# Altium schematic sheet Main.SchDoc
size A4
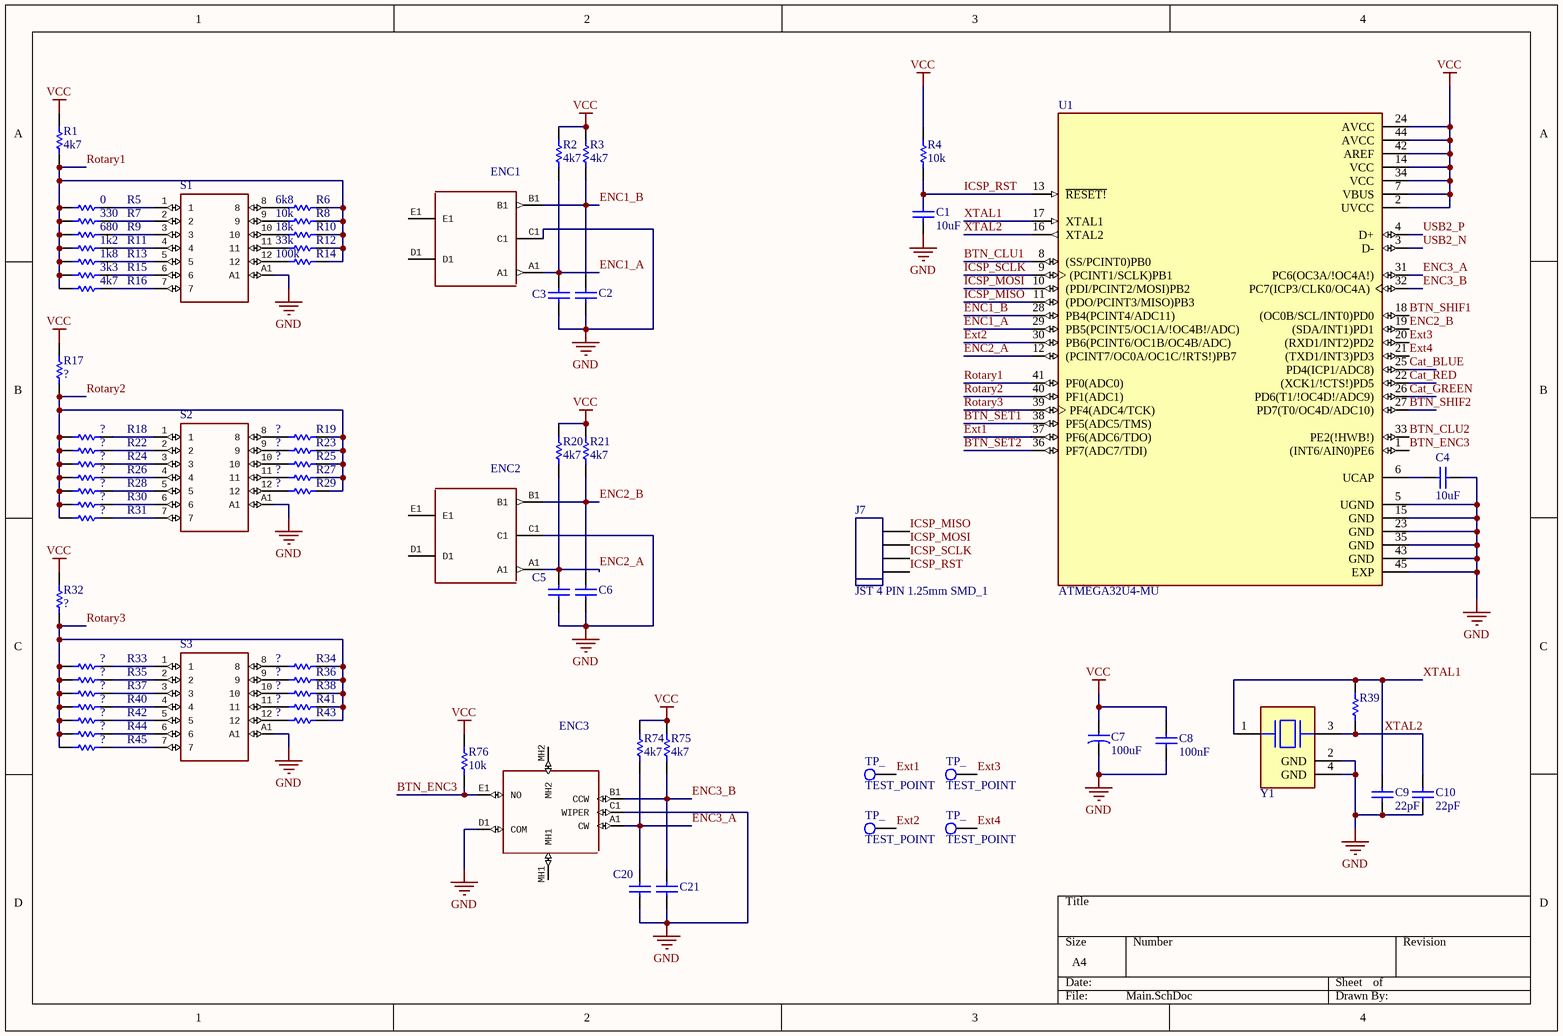
[diagram p0: Main.SchDoc]

## Parts
(Parts that share a designator on the sheet are numbered #1, #2 ... from top to bottom, then left to right.)
C1  10uF  [0603]
C2  100nF  [0603]  (value not drawn)
C3  100nF  [0603]  (value not drawn)
C4  10uF  [0603]
C5  100nF  [0603]  (value not drawn)
C6  100nF  [0603]  (value not drawn)
C7  100uF  [CAPPC3528X210N]
C8  100nF  [0603]
C9  22pF  [0603]
C10  22pF  [0603]
C20  100nF  [0603]  (value not drawn)
C21  100nF  [0603]  (value not drawn)
ENC1  Horz Encoder  [EC11B15242AF]  (value not drawn)
ENC2  Horz Encoder  [EC11B15242AF]  (value not drawn)
ENC3  EC1110120201  [EC1110120201]  (value not drawn)
J7  JST 4 PIN 1.25mm SMD_1  [JST 4 Pin 1.25mm]
R1  value 4k7  [0603]
R2  value 4k7  [0603]  (hidden comment: RESISTOR GENERIC)
R3  value 4k7  [0603]  (hidden comment: RESISTOR GENERIC)
R4  value 10k  [0603]  (hidden comment: RESISTOR GENERIC)
R5  value 0  [0603]  (hidden comment: RESISTOR GENERIC)
R6  value 6k8  [0603]  (hidden comment: RESISTOR GENERIC)
R7  value 330  [0603]  (hidden comment: RESISTOR GENERIC)
R8  value 10k  [0603]  (hidden comment: RESISTOR GENERIC)
R9  value 680  [0603]  (hidden comment: RESISTOR GENERIC)
R10  value 18k  [0603]  (hidden comment: RESISTOR GENERIC)
R11  value 1k2  [0603]  (hidden comment: RESISTOR GENERIC)
R12  value 33k  [0603]  (hidden comment: RESISTOR GENERIC)
R13  value 1k8  [0603]  (hidden comment: RESISTOR GENERIC)
R14  value 100k  [0603]  (hidden comment: RESISTOR GENERIC)
R15  value 3k3  [0603]  (hidden comment: RESISTOR GENERIC)
R16  value 4k7  [0603]  (hidden comment: RESISTOR GENERIC)
R17  RESISTOR GENERIC  [0603]  (value not drawn)
R18  RESISTOR GENERIC  [0603]  (value not drawn)
R19  RESISTOR GENERIC  [0603]  (value not drawn)
R20  value 4k7  [0603]  (hidden comment: RESISTOR GENERIC)
R21  value 4k7  [0603]  (hidden comment: RESISTOR GENERIC)
R22  RESISTOR GENERIC  [0603]  (value not drawn)
R23  RESISTOR GENERIC  [0603]  (value not drawn)
R24  RESISTOR GENERIC  [0603]  (value not drawn)
R25  RESISTOR GENERIC  [0603]  (value not drawn)
R26  RESISTOR GENERIC  [0603]  (value not drawn)
R27  RESISTOR GENERIC  [0603]  (value not drawn)
R28  RESISTOR GENERIC  [0603]  (value not drawn)
R29  RESISTOR GENERIC  [0603]  (value not drawn)
R30  RESISTOR GENERIC  [0603]  (value not drawn)
R31  RESISTOR GENERIC  [0603]  (value not drawn)
R32  RESISTOR GENERIC  [0603]  (value not drawn)
R33  RESISTOR GENERIC  [0603]  (value not drawn)
R34  RESISTOR GENERIC  [0603]  (value not drawn)
R35  RESISTOR GENERIC  [0603]  (value not drawn)
R36  RESISTOR GENERIC  [0603]  (value not drawn)
R37  RESISTOR GENERIC  [0603]  (value not drawn)
R38  RESISTOR GENERIC  [0603]  (value not drawn)
R39  RESISTOR GENERIC  [0603]  (value not drawn)
R40  RESISTOR GENERIC  [0603]  (value not drawn)
R41  RESISTOR GENERIC  [0603]  (value not drawn)
R42  RESISTOR GENERIC  [0603]  (value not drawn)
R43  RESISTOR GENERIC  [0603]  (value not drawn)
R44  RESISTOR GENERIC  [0603]  (value not drawn)
R45  RESISTOR GENERIC  [0603]  (value not drawn)
R74  value 4k7  [0603]  (hidden comment: RESISTOR GENERIC)
R75  value 4k7  [0603]  (hidden comment: RESISTOR GENERIC)
R76  value 10k  [0603]  (hidden comment: RESISTOR GENERIC)
S1  <b>Rotary wafer switch,metric,BBM,1P 12way 150 mA@ 250V, 12 Way Rotary Switch, 250 V ac, 250 V dc</b><p> / Source: <a href="https://www.mouser.co.uk/datasheet/2/242/CK-681.pdf"> Datasheet </a>  [CK1059]  (value not drawn)
S2  <b>Rotary wafer switch,metric,BBM,1P 12way 150 mA@ 250V, 12 Way Rotary Switch, 250 V ac, 250 V dc</b><p> / Source: <a href="https://www.mouser.co.uk/datasheet/2/242/CK-681.pdf"> Datasheet </a>  [CK1059]  (value not drawn)
S3  <b>Rotary wafer switch,metric,BBM,1P 12way 150 mA@ 250V, 12 Way Rotary Switch, 250 V ac, 250 V dc</b><p> / Source: <a href="https://www.mouser.co.uk/datasheet/2/242/CK-681.pdf"> Datasheet </a>  [CK1059]  (value not drawn)
TP_#1  TEST_POINT  [TEST_POINT]  (no BOM)
TP_#2  TEST_POINT  [TEST_POINT]  (no BOM)
TP_#3  TEST_POINT  [TEST_POINT]  (no BOM)
TP_#4  TEST_POINT  [TEST_POINT]  (no BOM)
U1  ATMEGA32U4-MU  [QFN50P700X700X100-45N]
Y1  XTAL 16MHz 30PPM SXC32M4-16.000-F16NLDT  [SMD3225-4P]  (value not drawn)

## Nets
GND: C1.1 C2.1 C3.1 C4.1 C5.1 C6.1 C7.2(-) C8.1 C9.1 C10.1 C20.1 C21.1 ENC1.C1 ENC2.C1 ENC3.C1(WIPER) ENC3.D1(COM) S1.A1 S2.A1 S3.A1 U1.5(UGND) U1.15(GND) U1.23(GND) U1.35(GND) U1.43(GND) U1.45(EXP) Y1.2(GND) Y1.4(GND)
VCC: C7.1(+) C8.2 R1.2 R2.2 R3.2 R4.2 R17.2 R20.2 R21.2 R32.2 R74.2 R75.2 R76.2 U1.2(UVCC) U1.7(VBUS) U1.14(VCC) U1.24(AVCC) U1.34(VCC) U1.42(AREF) U1.44(AVCC)
BTN_CLU1: U1.8((SS/PCINT0)PB0)
BTN_CLU2: U1.33(PE2(!HWB!))
BTN_ENC3: ENC3.E1(NO) R76.1 U1.1((INT6/AIN0)PE6)
BTN_SET1: U1.38(PF5(ADC5/TMS))
BTN_SET2: U1.36(PF7(ADC7/TDI))
BTN_SHIF1: U1.18((OC0B/SCL/INT0)PD0)
BTN_SHIF2: U1.27(PD7(T0/OC4D/ADC10))
Cat_BLUE: U1.25(PD4(ICP1/ADC8))
Cat_GREEN: U1.26(PD6(T1/!OC4D!/ADC9))
Cat_RED: U1.22((XCK1/!CTS!)PD5)
ENC1_A: C3.2 ENC1.A1 R2.1 U1.29(PB5(PCINT5/OC1A/!OC4B!/ADC))
ENC1_B: C2.2 ENC1.B1 R3.1 U1.28(PB4(PCINT4/ADC11))
ENC2_A: C5.2 ENC2.A1 R20.1 U1.12((PCINT7/OC0A/OC1C/!RTS!)PB7)
ENC2_B: C6.2 ENC2.B1 R21.1 U1.19((SDA/INT1)PD1)
ENC3_A: C20.2 ENC3.A1(CW) R74.1 U1.31(PC6(OC3A/!OC4A!))
ENC3_B: C21.2 ENC3.B1(CCW) R75.1 U1.32(PC7(ICP3/CLK0/OC4A))
Ext1: TP_#1.1(Test_Point) U1.37(PF6(ADC6/TDO))
Ext2: TP_#3.1(Test_Point) U1.30(PB6(PCINT6/OC1B/OC4B/ADC))
Ext3: TP_#2.1(Test_Point) U1.20((RXD1/INT2)PD2)
Ext4: TP_#4.1(Test_Point) U1.21((TXD1/INT3)PD3)
ICSP_MISO: J7.4 U1.11((PDO/PCINT3/MISO)PB3)
ICSP_MOSI: J7.3 U1.10((PDI/PCINT2/MOSI)PB2)
ICSP_RST: C1.2 J7.1 R4.1 U1.13(~{RESET!})
ICSP_SCLK: J7.2 U1.9((PCINT1/SCLK)PB1)
Rotary1: R1.1 R5.1 R6.2 R7.1 R8.2 R9.1 R10.2 R11.1 R12.2 R13.1 R14.2 R15.1 R16.1 U1.41(PF0(ADC0))
Rotary2: R17.1 R18.1 R19.2 R22.1 R23.2 R24.1 R25.2 R26.1 R27.2 R28.1 R29.2 R30.1 R31.1 U1.40(PF1(ADC1))
Rotary3: R32.1 R33.1 R34.2 R35.1 R36.2 R37.1 R38.2 R40.1 R41.2 R42.1 R43.2 R44.1 R45.1 U1.39(PF4(ADC4/TCK))
USB2_N: U1.3(D-)
USB2_P: U1.4(D+)
XTAL1: C9.2 R39.2 U1.17(XTAL1) Y1.1
XTAL2: C10.2 R39.1 U1.16(XTAL2) Y1.3
NetC4_2: C4.2 U1.6(UCAP)
NetR5_2: R5.2 S1.1
NetR6_1: R6.1 S1.8
NetR7_2: R7.2 S1.2
NetR8_1: R8.1 S1.9
NetR9_2: R9.2 S1.3
NetR10_1: R10.1 S1.10
NetR11_2: R11.2 S1.4
NetR12_1: R12.1 S1.11
NetR13_2: R13.2 S1.5
NetR14_1: R14.1 S1.12
NetR15_2: R15.2 S1.6
NetR16_2: R16.2 S1.7
NetR18_2: R18.2 S2.1
NetR19_1: R19.1 S2.8
NetR22_2: R22.2 S2.2
NetR23_1: R23.1 S2.9
NetR24_2: R24.2 S2.3
NetR25_1: R25.1 S2.10
NetR26_2: R26.2 S2.4
NetR27_1: R27.1 S2.11
NetR28_2: R28.2 S2.5
NetR29_1: R29.1 S2.12
NetR30_2: R30.2 S2.6
NetR31_2: R31.2 S2.7
NetR33_2: R33.2 S3.1
NetR34_1: R34.1 S3.8
NetR35_2: R35.2 S3.2
NetR36_1: R36.1 S3.9
NetR37_2: R37.2 S3.3
NetR38_1: R38.1 S3.10
NetR40_2: R40.2 S3.4
NetR41_1: R41.1 S3.11
NetR42_2: R42.2 S3.5
NetR43_1: R43.1 S3.12
NetR44_2: R44.2 S3.6
NetR45_2: R45.2 S3.7

Not connected (* = marked no-connect by the designer): ENC1 D1 E1; ENC2 D1 E1; ENC3 MH1 MH2

## Library data of the parts
C1 C4 = CAP 10uF 6.3V 20% 0603: Supplier 1: Digi-Key; Supplier Part Number 1: 1276-1119-1-ND
C2 C3 C5 C6 C8 C20 C21 = CAP 100nF 10V 10% 0603: Supplier 1: Digi-Key; Supplier Part Number 1: 399-1095-1-ND
C7 = CAP TANT 100uF 6.3V 20%: Supplier 1: Digi-Key; Supplier Part Number 1: 478-8156-1-ND
C9 C10 = CAP 22pF 5% 50V 0603: Supplier 1: Digi-Key; Supplier Part Number 1: 445-1273-1-ND
ENC1 ENC2 = EC11B15242AF: Manufacturer_Name: ALPS; Manufacturer_Part_Number: EC11B15242AF; Mouser_Part_Number: 688-EC11B15242AF; Mouser_Price-Stock: https://www.mouser.co.uk/ProductDetail/ALPS/EC11B15242AF?qs=N5Jky1br14N4kifLZnXtkw%3D%3D; Height: 13.75mm
ENC3 = EC1110120201: Manufacturer_Name: ALPS; Manufacturer_Part_Number: EC1110120201; Mouser_Part_Number: 688-EC1110120201; Mouser_Price-Stock: https://www.mouser.com/Search/Refine.aspx?Keyword=688-EC1110120201; Height: 25mm
R1 = RESISTOR GENERIC
S1-S3 = CK1049: Manufacturer_Name: Lorlin; Manufacturer_Part_Number: CK1049; Mouser_Part_Number: 105-CK1049; Mouser_Price-Stock: https://www.mouser.co.uk/ProductDetail/Lorlin/CK1049?qs=O6bH0TOr7K9VZeVQd5au3Q%3D%3D; Height: mm
U1 = ATMEGA32U4-MU: AVR AVRÂ® ATmega Microcontroller IC 8-Bit 16MHz 32KB (16K x 16) FLASH 44-VQFN (7x7); MF: Microchip Technology / Atmel; Value: *; SnapEDA_Link: https://www.snapeda.com/parts/ATMEGA32U4-MU/Atmel/view-part/4702009/?ref=snap; Availability: Good; Package: VFQFN-44 Microchip Technology / Atmel; MP: ATMEGA32U4-MU
Y1 = XTAL 16MHz 30PPM SXC32M4-16.000-F16NLDT: Crystals 16MHz 16pF 10PPM -40 +85C; Manufacturer: HCI; LCSC Part: C2925591; Part number: XC32M4-16.000-F16NLDT
J7 = JST 4 PIN 1.25mm SMD_1: Supplier 1: LCSC; Supplier Part Number 1: C668615
R2-R45 R74-R76 = RESISTOR GENERIC
  R17-R19 R22-R38 R40-R45: Value: ?